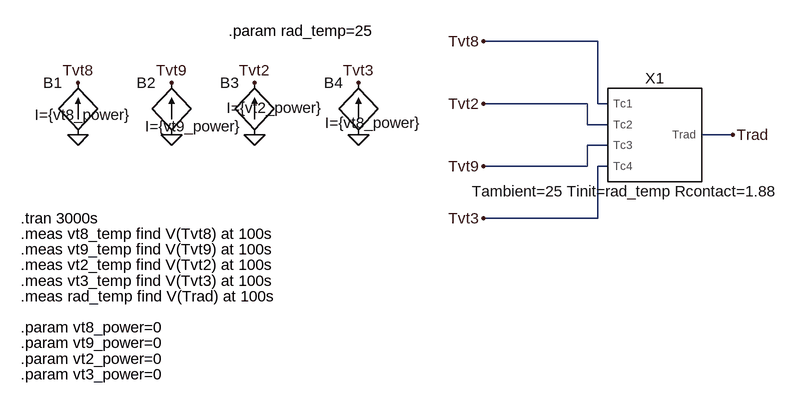
[diagram p0: schematic MotorControlThermalOnly.asc]
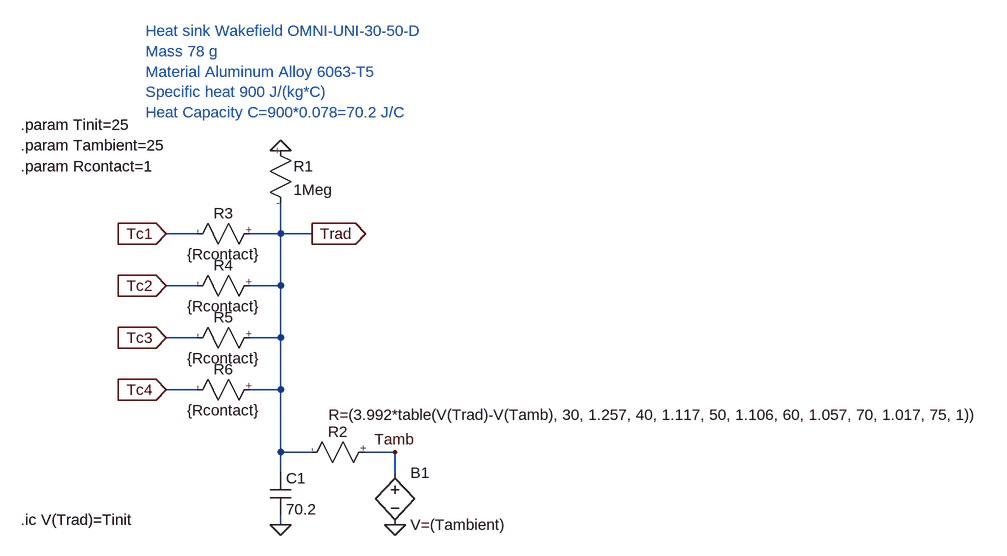
[diagram p1: sub-circuit radiator.asc]
MotorControlThermalOnly.asc, the LTspice schematic file:
Version 4
SHEET 1 880 680
WIRE 192 -48 16 -48
WIRE 176 48 16 48
WIRE 192 48 192 -48
WIRE 208 48 192 48
WIRE 176 80 176 48
WIRE 208 80 176 80
WIRE 400 96 352 96
WIRE 208 112 176 112
WIRE 176 144 176 112
WIRE 176 144 16 144
WIRE 208 144 192 144
WIRE 192 224 192 144
WIRE 192 224 16 224
FLAG 16 -48 Tvt8
FLAG 16 48 Tvt2
FLAG 16 144 Tvt9
FLAG 16 224 Tvt3
FLAG 400 96 Trad
FLAG -608 16 Tvt8
FLAG -336 16 Tvt2
FLAG -464 16 Tvt9
FLAG -176 16 Tvt3
FLAG -608 96 0
FLAG -336 96 0
FLAG -464 96 0
FLAG -176 96 0
SYMBOL Radiator 272 96 R0
WINDOW 39 -36 102 Bottom 2
SYMATTR SpiceLine Tambient=25 Tinit=rad_temp Rcontact=1.88
SYMATTR InstName X1
SYMBOL bi -608 96 R180
WINDOW 0 24 80 Left 2
WINDOW 3 -83 31 Left 2
SYMATTR InstName B1
SYMATTR Value I={vt8_power}
SYMBOL bi -464 96 R180
WINDOW 0 24 80 Left 2
WINDOW 3 -109 13 Left 2
SYMATTR InstName B2
SYMATTR Value I={vt9_power}
SYMBOL bi -336 96 R180
WINDOW 0 24 80 Left 2
WINDOW 3 -106 42 Left 2
SYMATTR InstName B3
SYMATTR Value I={vt2_power}
SYMBOL bi -176 96 R180
WINDOW 0 24 80 Left 2
WINDOW 3 -98 19 Left 2
SYMATTR InstName B4
SYMATTR Value I={vt8_power}
TEXT -376 -64 Left 2 !.param rad_temp=25
TEXT -696 224 Left 2 !.tran 3000s
TEXT -696 248 Left 2 !.meas vt8_temp find V(Tvt8) at 100s
TEXT -696 272 Left 2 !.meas vt9_temp find V(Tvt9) at 100s
TEXT -696 296 Left 2 !.meas vt2_temp find V(Tvt2) at 100s
TEXT -696 320 Left 2 !.meas vt3_temp find V(Tvt3) at 100s
TEXT -696 344 Left 2 !.meas rad_temp find V(Trad) at 100s
TEXT -696 392 Left 2 !.param vt8_power=0
TEXT -696 416 Left 2 !.param vt9_power=0
TEXT -696 440 Left 2 !.param vt2_power=0
TEXT -696 464 Left 2 !.param vt3_power=0

radiator.asc, the sub-circuit schematic file:
Version 4
SHEET 1 1676 680
WIRE 144 80 96 80
WIRE 272 80 272 32
WIRE 272 80 224 80
WIRE 320 80 272 80
WIRE 144 160 96 160
WIRE 272 160 272 80
WIRE 272 160 224 160
WIRE 144 240 96 240
WIRE 272 240 272 160
WIRE 272 240 224 240
WIRE 144 320 96 320
WIRE 272 320 272 240
WIRE 272 320 224 320
WIRE 272 416 272 320
WIRE 320 416 272 416
WIRE 448 416 400 416
WIRE 272 448 272 416
WIRE 448 448 448 416
WIRE 272 528 272 512
FLAG 96 80 Tc1
IOPIN 96 80 In
FLAG 96 160 Tc2
IOPIN 96 160 In
FLAG 96 240 Tc3
IOPIN 96 240 In
FLAG 96 320 Tc4
IOPIN 96 320 In
FLAG 448 528 0
FLAG 448 416 Tamb
FLAG 320 80 Trad
IOPIN 320 80 Out
FLAG 272 528 0
FLAG 272 -48 0
SYMBOL bv 448 432 R0
SYMATTR InstName B1
SYMATTR Value V=(Tambient)
SYMBOL cap 256 448 R0
SYMATTR InstName C1
SYMATTR Value 70.2
SYMBOL res 256 -64 R0
SYMATTR InstName R1
SYMATTR Value 1Meg
SYMBOL res 416 400 R90
WINDOW 0 0 56 VBottom 2
WINDOW 3 -57 -436 VTop 2
SYMATTR InstName R2
SYMATTR Value R=(3.992*table(V(Trad)-V(Tamb), 30, 1.257, 40, 1.117, 50, 1.106, 60, 1.057, 70, 1.017, 75, 1))
SYMBOL res 240 64 R90
WINDOW 0 0 56 VBottom 2
WINDOW 3 32 56 VTop 2
SYMATTR InstName R3
SYMATTR Value {Rcontact}
SYMBOL res 240 144 R90
WINDOW 0 0 56 VBottom 2
WINDOW 3 32 56 VTop 2
SYMATTR InstName R4
SYMATTR Value {Rcontact}
SYMBOL res 240 224 R90
WINDOW 0 0 56 VBottom 2
WINDOW 3 32 56 VTop 2
SYMATTR InstName R5
SYMATTR Value {Rcontact}
SYMBOL res 240 304 R90
WINDOW 0 0 56 VBottom 2
WINDOW 3 32 56 VTop 2
SYMATTR InstName R6
SYMATTR Value {Rcontact}
TEXT -128 -56 Left 2 !.param Tambient=25
TEXT 64 -232 Left 2 ;Heat sink Wakefield OMNI-UNI-30-50-D\nMass 78 g\nMaterial Aluminum Alloy 6063-T5\nSpecific heat 900 J/(kg*C)\nHeat Capacity C=900*0.078=70.2 J/C
TEXT -128 -24 Left 2 !.param Rcontact=1
TEXT -128 520 Left 2 !.ic V(Trad)=Tinit
TEXT -128 -88 Left 2 !.param Tinit=25

The netlist it stands for:
* MotorControlThermalOnly.asc
XX1 Tvt8 Tvt2 Tvt9 Tvt3 Trad radiator params: Tambient=25 Tinit=rad_temp Rcontact=1.88
B1 0 Tvt8 I={vt8_power}
B2 0 Tvt9 I={vt9_power}
B3 0 Tvt2 I={vt2_power}
B4 0 Tvt3 I={vt8_power}

* block symbol definitions
.subckt radiator Tc1 Tc2 Tc3 Tc4 Trad
B1 Tamb 0 V=(Tambient)
C1 Trad 0 70.2
R1 0 Trad 1Meg
R2 Tamb Trad R=(3.992*table(V(Trad)-V(Tamb), 30, 1.257, 40, 1.117, 50, 1.106, 60, 1.057, 70, 1.017, 75, 1))
R3 Trad Tc1 {Rcontact}
R4 Trad Tc2 {Rcontact}
R5 Trad Tc3 {Rcontact}
R6 Trad Tc4 {Rcontact}
.param Tambient=25
* Heat sink Wakefield OMNI-UNI-30-50-D
* Mass 78 g
* Material Aluminum Alloy 6063-T5
* Specific heat 900 J/(kg*C)
* Heat Capacity C=900*0.078=70.2 J/C
.param Rcontact=1
.ic V(Trad)=Tinit
.param Tinit=25
.ends radiator

.param rad_temp=25
.tran 3000s
.meas vt8_temp find V(Tvt8) at 100s
.meas vt9_temp find V(Tvt9) at 100s
.meas vt2_temp find V(Tvt2) at 100s
.meas vt3_temp find V(Tvt3) at 100s
.meas rad_temp find V(Trad) at 100s
.param vt8_power=0
.param vt9_power=0
.param vt2_power=0
.param vt3_power=0
.backanno
.end